# EAGLE schematic PCB_Expedidora_V2.0_Rasp (EAGLE 8.7.0)
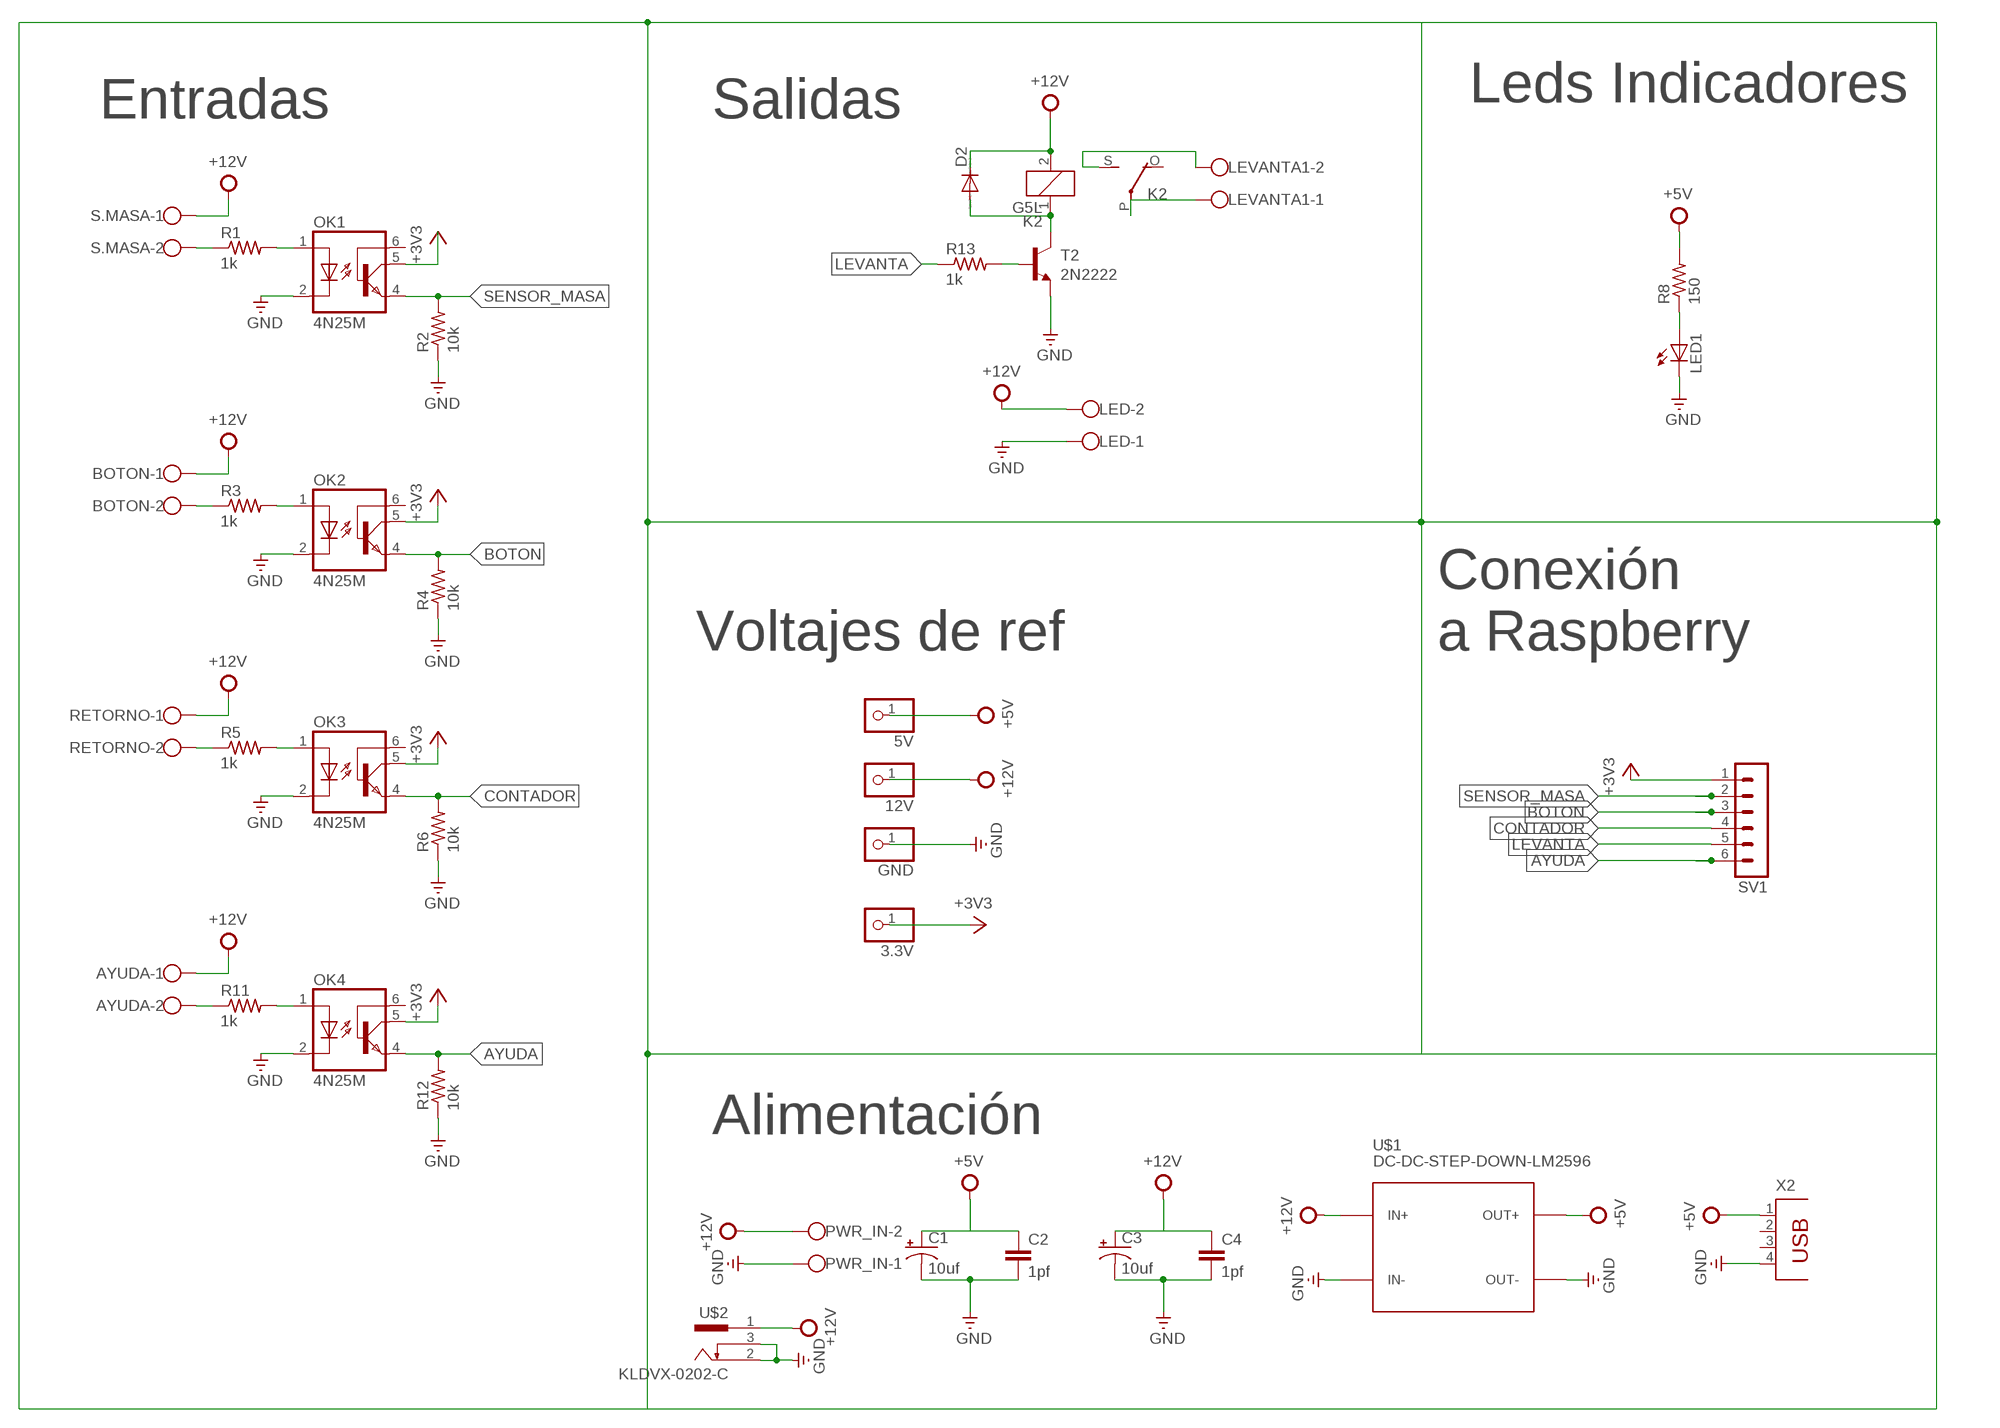
[diagram p0: schematic, sheet 1]

## Parts
3.3V  PINHD-1X1  [1X01]
5V  PINHD-1X1  [1X01]
12V  PINHD-1X1  [1X01]
AYUDA  W237-102  [W237-102]
BOTON  W237-102  [W237-102]
C1  10uf  CPOL-USE2.5-6  [E2,5-6]
C2  1pf  C2,5-3  [C2.5-3]
C3  10uf  CPOL-USE2.5-6  [E2,5-6]
C4  1pf  C2,5-3  [C2.5-3]
D2  1N4148DO35-7  [DO35-7]
GND  PINHD-1X1  [1X01]
K2  G5L  [G5LE]
LED  W237-102  [W237-102]
LED1  LED5MM  [LED5MM]
LEVANTA1  W237-102  [W237-102]
OK1  4N25M  [DIL06]
OK2  4N25M  [DIL06]
OK3  4N25M  [DIL06]
OK4  4N25M  [DIL06]
PWR_IN  W237-102  [W237-102]
R1  1k  R-US_0207/7  [0207/7]
R2  10k  R-US_0207/7  [0207/7]
R3  1k  R-US_0207/7  [0207/7]
R4  10k  R-US_0207/7  [0207/7]
R5  1k  R-US_0207/7  [0207/7]
R6  10k  R-US_0207/7  [0207/7]
R8  150  R-US_0207/7  [0207/7]
R11  1k  R-US_0207/7  [0207/7]
R12  10k  R-US_0207/7  [0207/7]
R13  1k  R-US_0207/7  [0207/7]
RETORNO  W237-102  [W237-102]
S.MASA  W237-102  [W237-102]
SV1  MA06-1  [MA06-1]
T2  2N2222  [TO18]
U$1  DC-DC-STEP-DOWN-LM2596  [DC-DC-STEP-DOWN-LM2596]
U$2  KLDVX-0202-C  [KLDVX-0202-C]
X2  PN87520  [PN87520]

## Nets
+3V3: 3.3V.1 OK1.5(COL) OK2.5(COL) OK3.5(COL) OK4.5(COL) SV1.1
+5V: 5V.1 C1.+ C2.1 R8.2 U$1.OUT+ X2.1
+12V: 12V.1 AYUDA.1 BOTON.1 C3.+ C4.1 D2.C K2.2 LED.2 PWR_IN.2 RETORNO.1 S.MASA.1 U$1.IN+ U$2.1
AYUDA: OK4.4(EMI) R12.2 SV1.6
BOTON: OK2.4(EMI) R4.2 SV1.3
CONTADOR: OK3.4(EMI) R6.2 SV1.4
GND: C1.- C2.2 C3.- C4.2 GND.1 LED1.K(C) LED.1 OK1.2(C) OK2.2(C) OK3.2(C) OK4.2(C) PWR_IN.1 R2.1 R4.1 R6.1 R12.1 T2.1(E) U$1.IN- U$1.OUT- U$2.2 U$2.3 X2.4
LEVANTA: R13.1 SV1.5
N$1: R1.1 S.MASA.2
N$2: BOTON.2 R3.1
N$3: OK1.1(A) R1.2
N$4: OK2.1(A) R3.2
N$6: R5.1 RETORNO.2
N$7: OK3.1(A) R5.2
N$9: AYUDA.2 R11.1
N$11: OK4.1(A) R11.2
N$13: LED1.A R8.1
N$17: D2.A K2.1 T2.3(C)
N$18: R13.2 T2.2(B)
N$19: K2.S(2:S) LEVANTA1.2
N$20: K2.P(2:P) LEVANTA1.1
SENSOR_MASA: OK1.4(EMI) R2.2 SV1.2
Unconnected: K2.O(2:O) OK1.6(BAS) OK2.6(BAS) OK3.6(BAS) OK4.6(BAS) U$2.1@1 U$2.2@1 U$2.3@1 X2.2 X2.3

## Notes on the sheet
- Entradas | Salidas | Leds Indicadores
- Voltajes de ref
- Conexión 
  a Raspberry
- Alimentación

## Library data of the parts
3.3V 5V 12V GND = adafruit:PINHD-1X1: Pin header 1x1 for 0.1" spacing With round pins
AYUDA BOTON LED LEVANTA1 PWR_IN RETORNO S.MASA = con-wago-500:W237-102: WAGO SCREW CLAMP; MPN: 237-102; OC_FARNELL: unknown; OC_NEWARK: 70K9898
C1 C3 = adafruit:CPOL-US: POLARIZED CAPACITOR, American symbol
C2 C4 = capacitor-wima:C: CAPACITOR naming: grid - package width
D2 = diode:1N4148: DIODE high speed (Philips)
K2 = relay:G5L: RELAY 1 x switch, 10 A/120 V AC, 8 A/30 V ADC, Omron; OC_FARNELL: unknown; OC_NEWARK: unknown
LED1 = adafruit:LED: LED OSRAM: - CHIPLED LG R971, LG N971, LY N971, LG Q971, LY Q971, LO R971, LY R971 LH N974, LH R974 LS Q976, LO Q976, LY Q976 LO Q996 - Hyper CHIPLED LW Q18S LB Q993, LB Q99A, LB R99A - SideLED LS A670, LO A670, LY A670, LG A670, LP A670 LB A673, LV A673, LT A673, LW A673 LH A674 LY A675 LS A676, LA A676, LO A676, LY A676, LW A676 LS A679, LY A679, LG A679 - Hyper Micro SIDELED® LS Y876, LA Y876, LO Y876, LY Y876 LT Y87S - SmartLED LW L88C, LW L88S LB L89C, LB L89S, LG L890 LS L89K, LO L89K, LY L89K LS L896, LA L896, LO L896, LY L896 - TOPLED LS T670, LO T670, LY T670, LG T670, LP T670 LSG T670, LSP T670, LSY T670, LOP T670, LYG T670 LG T671, LOG T671, LSG T671 LB T673, LV T673, LT T673, LW T673 LH T674 LS T676, LA T676, LO T676, LY T676, LB T676, LH T676, LSB T676, LW T676 LB T67C, LV T67C, LT T67C, LS T67K, LO T67K, LY T67K, LW E67C LS E67B, LA E67B, LO E67B, LY E67B, LB E67C, LV E67C, LT E67C LW T67C LS T679, LY T679, LG T679 LS T770, LO T770, LY T770, LG T770, LP T770 LB T773, LV T773, LT T773, LW T773 LH T774 LS E675, LA E675, LY E675, LS T675 LS T776, LA T776, LO T776, LY T776, LB T776 LHGB T686 LT T68C, LB T68C - Hyper Mini TOPLED® LB M676 - Mini TOPLED Santana® LG M470 LS M47K, LO M47K, LY M47K Source: http://www.osram.convergy.de/
OK1-OK4 = optocoupler:4N*?M: General Purpose 6-Pin Phototransistor Optocouplers Source: http://www.fairchildsemi.com/ds/4N/4N35-M.pdf; MPN: 4N25-M; OC_FARNELL: 1021349; OC_NEWARK: 98K9084
R1-R6 R8 R11-R13 = rcl:R-US_: RESISTOR, American symbol; SPICEPREFIX: R
SV1 = con-lstb:MA06-1: PIN HEADER; OC_FARNELL: unknown; OC_NEWARK: unknown
T2 = transistor:2N2222: NPN TRANSISTOR
U$1 = diy-modules:DC-DC-STEP-DOWN-LM2596: DC/DC Step-Down Regulator based on LM2596-ADJ chip LM2596 datasheet available here: http://www.ti.com/lit/ds/symlink/lm2596.pdf Click here to find device on ebay.com <http://www.ebay.com/sch/lm2596+power+regulator>
U$2 = con-kycon:KLDVX-0202-: Power Jack, Vertical, PCB Mount, 2.0 mm, 2.5 mm, 3.0 mm Center Pin Source: KLDVX-0202x.pdf; OC_FARNELL: unknown; OC_NEWARK: unknown
X2 = con-berg:PN87520: BERG USB connector; OC_FARNELL: unknown; OC_NEWARK: unknown